# Altium project LineDetector.PrjPcb
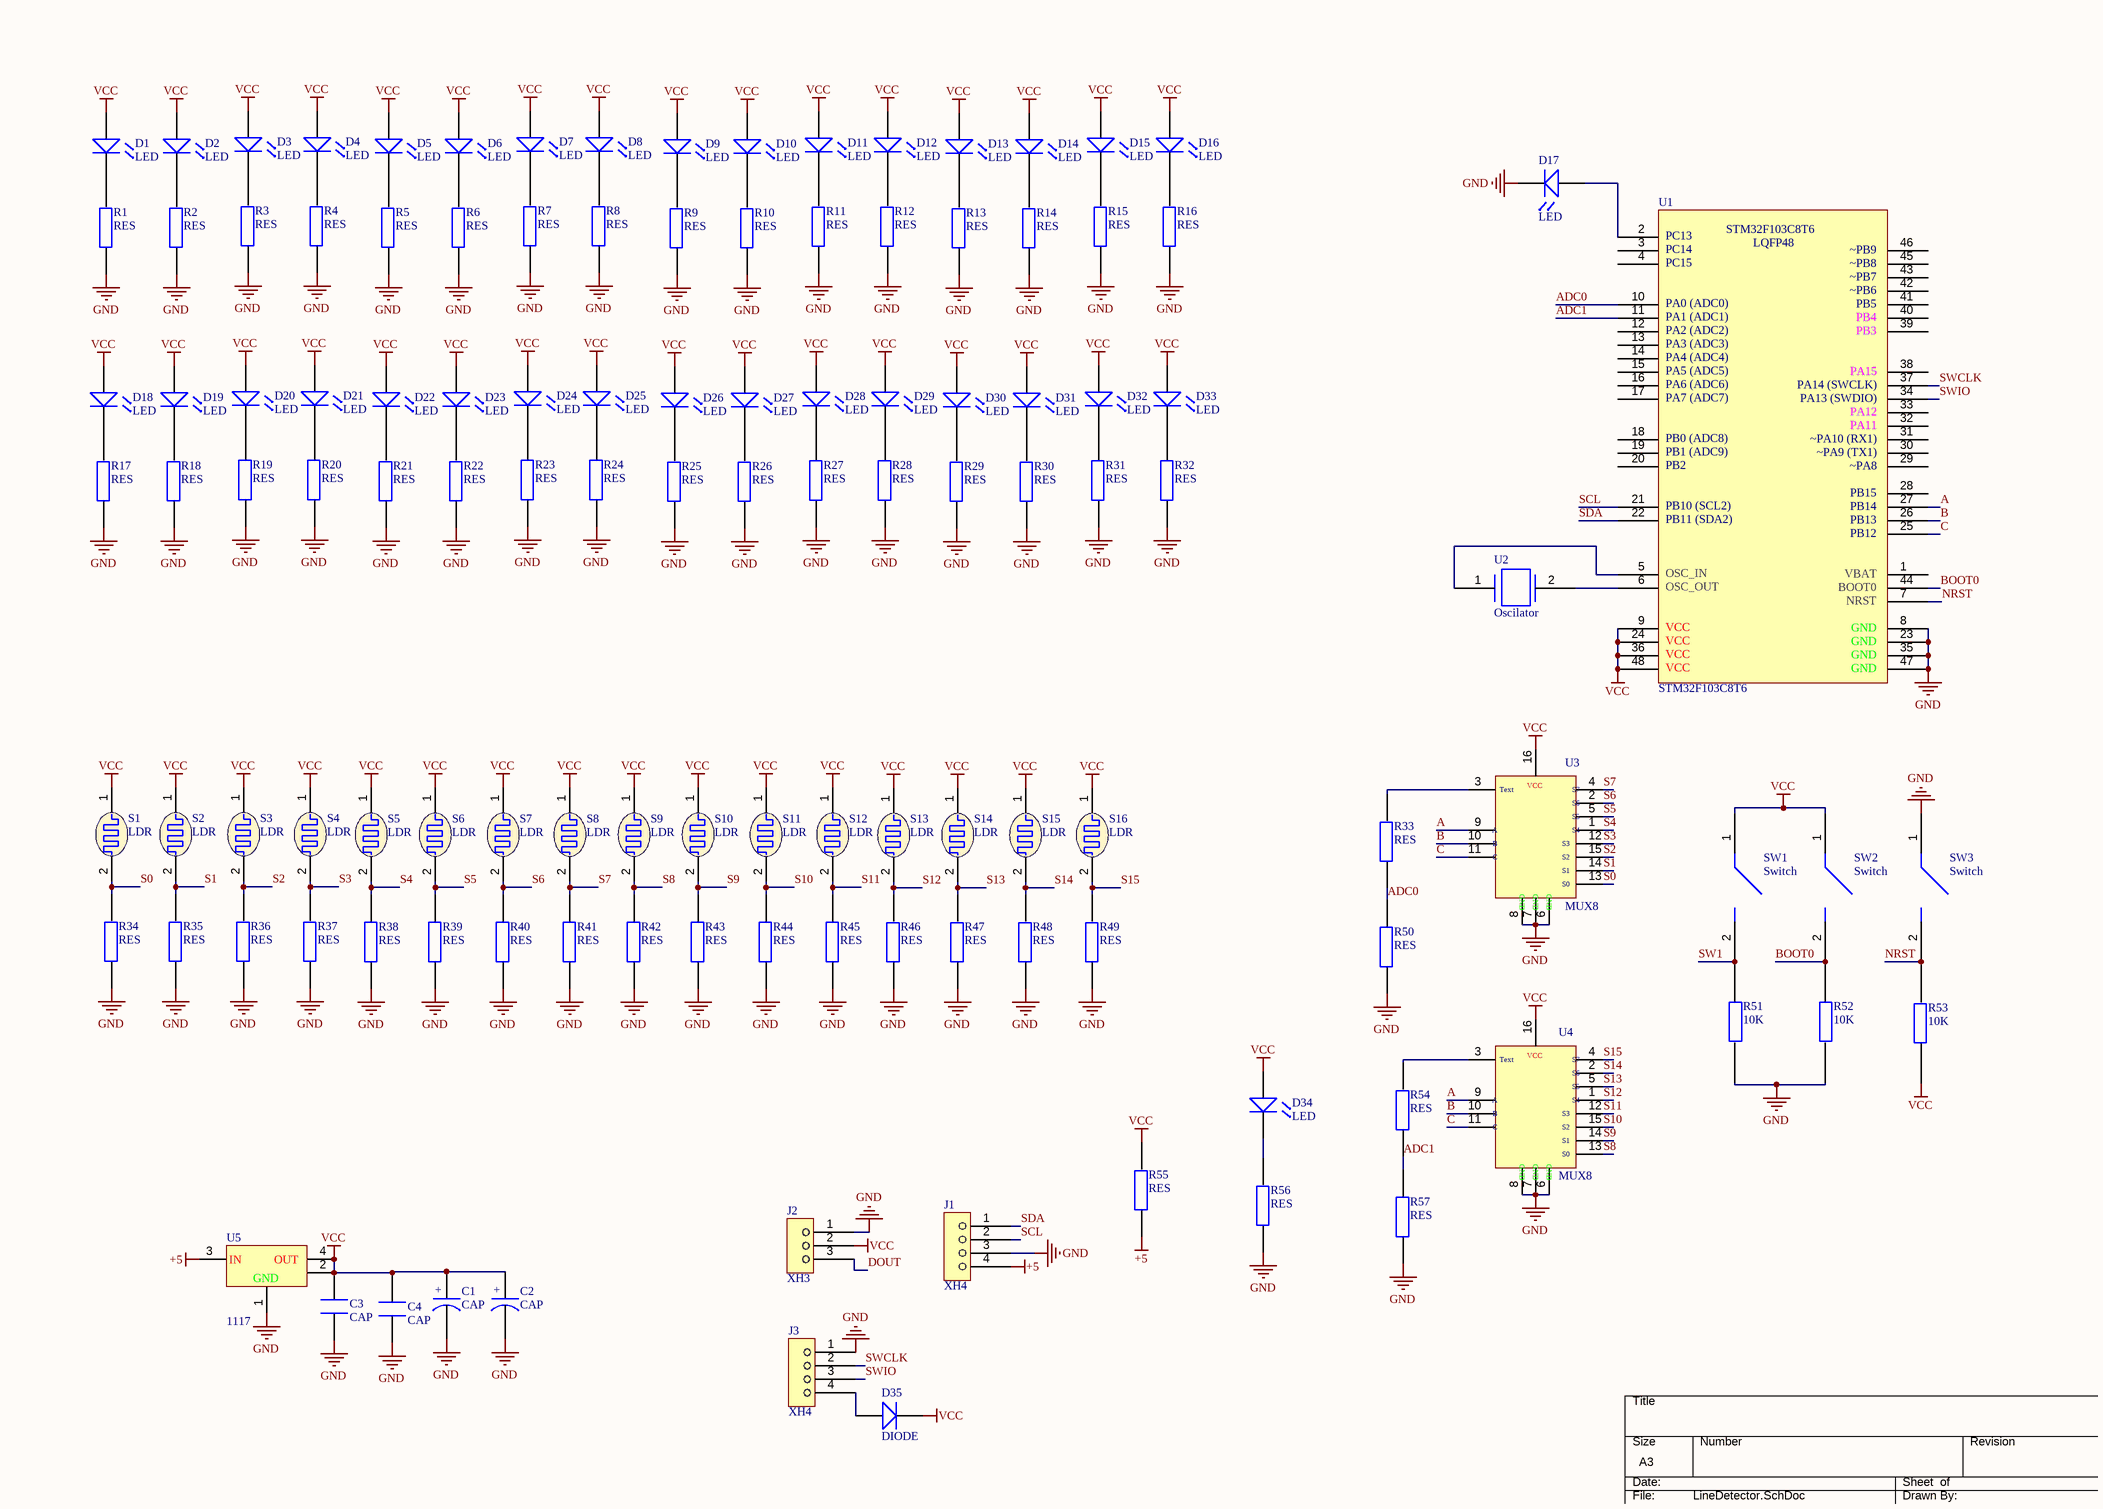
[diagram p0: LineDetector.SchDoc]
1 sheet, 123 parts. Net scope: global (net labels, ports and power ports of the same name join across sheets).
Board file: LineDetector.PcbDoc

## Sheet LineDetector.SchDoc
size A3; SheetNumber: 1; SheetTotal: 1

### Parts
C1  CAP  [CAP SMD 100uF 16V]
C2  CAP  [CAP SMD 100uF 16V]
C3  CAP  [CAP1206]
C4  CAP  [CAP1206]
D1  LED  [LED RED 1206]
D2  LED  [LED RED 1206]
D3  LED  [LED RED 1206]
D4  LED  [LED RED 1206]
D5  LED  [LED RED 1206]
D6  LED  [LED RED 1206]
D7  LED  [LED RED 1206]
D8  LED  [LED RED 1206]
D9  LED  [LED RED 1206]
D10  LED  [LED RED 1206]
D11  LED  [LED RED 1206]
D12  LED  [LED RED 1206]
D13  LED  [LED RED 1206]
D14  LED  [LED RED 1206]
D15  LED  [LED RED 1206]
D16  LED  [LED RED 1206]
D17  LED  [LED GREEN 1206]
D18  LED  [LED RED 1206]
D19  LED  [LED RED 1206]
D20  LED  [LED RED 1206]
D21  LED  [LED RED 1206]
D22  LED  [LED RED 1206]
D23  LED  [LED RED 1206]
D24  LED  [LED RED 1206]
D25  LED  [LED RED 1206]
D26  LED  [LED RED 1206]
D27  LED  [LED RED 1206]
D28  LED  [LED RED 1206]
D29  LED  [LED RED 1206]
D30  LED  [LED RED 1206]
D31  LED  [LED RED 1206]
D32  LED  [LED RED 1206]
D33  LED  [LED RED 1206]
D34  LED  [LED GREEN 1206]
D35  DIODE  [Diode]
J1  XH4  [XH 4PIN]
J2  XH3  [XH 3PIN]
J3  XH4  [XH 4PIN]
R1  RES  [RES805]
R2  RES  [RES805]
R3  RES  [RES805]
R4  RES  [RES805]
R5  RES  [RES805]
R6  RES  [RES805]
R7  RES  [RES805]
R8  RES  [RES805]
R9  RES  [RES805]
R10  RES  [RES805]
R11  RES  [RES805]
R12  RES  [RES805]
R13  RES  [RES805]
R14  RES  [RES805]
R15  RES  [RES805]
R16  RES  [RES805]
R17  RES  [RES805]
R18  RES  [RES805]
R19  RES  [RES805]
R20  RES  [RES805]
R21  RES  [RES805]
R22  RES  [RES805]
R23  RES  [RES805]
R24  RES  [RES805]
R25  RES  [RES805]
R26  RES  [RES805]
R27  RES  [RES805]
R28  RES  [RES805]
R29  RES  [RES805]
R30  RES  [RES805]
R31  RES  [RES805]
R32  RES  [RES805]
R33  RES  [RES1206]
R34  RES  [RES805]
R35  RES  [RES805]
R36  RES  [RES805]
R37  RES  [RES805]
R38  RES  [RES805]
R39  RES  [RES805]
R40  RES  [RES805]
R41  RES  [RES805]
R42  RES  [RES805]
R43  RES  [RES805]
R44  RES  [RES805]
R45  RES  [RES805]
R46  RES  [RES805]
R47  RES  [RES805]
R48  RES  [RES805]
R49  RES  [RES805]
R50  RES  [RES1206]
R51  10K  [RES1206]
R52  10K  [RES1206]
R53  10K  [RES1206]
R54  RES  [RES1206]
R55  RES  [RES805]
R56  RES  [RES805]
R57  RES  [RES1206]
S1  LDR  [LDR]
S2  LDR  [LDR]
S3  LDR  [LDR]
S4  LDR  [LDR]
S5  LDR  [LDR]
S6  LDR  [LDR]
S7  LDR  [LDR]
S8  LDR  [LDR]
S9  LDR  [LDR]
S10  LDR  [LDR]
S11  LDR  [LDR]
S12  LDR  [LDR]
S13  LDR  [LDR]
S14  LDR  [LDR]
S15  LDR  [LDR]
S16  LDR  [LDR]
SW1  Switch  [pushbutton]
SW2  Switch  [pushbutton]
SW3  Switch  [pushbutton]
U1  STM32F103C8T6  [STM32F103C8T6]
U2  Oscilator  [Crystal Oscilator]
U3  MUX8  [4051 SMD]
U4  MUX8  [4051 SMD]
U5  1117  [AMS1117]

### Nets
+5: J1.4 R55.1 U5.3
GND: C1.1 C2.1 C3.1 C4.1 D17.2 J1.3 J2.1 J3.1 R1.1 R2.1 R3.1 R4.1 R5.1 R6.1 R7.1 R8.1 R9.1 R10.1 R11.1 R12.1 R13.1 R14.1 R15.1 R16.1 R17.1 R18.1 R19.1 R20.1 R21.1 R22.1 R23.1 R24.1 R25.1 R26.1 R27.1 R28.1 R29.1 R30.1 R31.1 R32.1 R34.1 R35.1 R36.1 R37.1 R38.1 R39.1 R40.1 R41.1 R42.1 R43.1 R44.1 R45.1 R46.1 R47.1 R48.1 R49.1 R50.1 R51.2 R52.2 R56.1 R57.1 SW3.1 U1.8 U1.23 U1.35 U1.47 U3.6 U3.7 U3.8 U4.6 U4.7 U4.8 U5.1
VCC: C1.2 C2.2 C3.2 C4.2 D1.1 D2.1 D3.1 D4.1 D5.1 D6.1 D7.1 D8.1 D9.1 D10.1 D11.1 D12.1 D13.1 D14.1 D15.1 D16.1 D18.1 D19.1 D20.1 D21.1 D22.1 D23.1 D24.1 D25.1 D26.1 D27.1 D28.1 D29.1 D30.1 D31.1 D32.1 D33.1 D34.1 D35.2 J2.2 R53.1 R55.2 S1.1 S2.1 S3.1 S4.1 S5.1 S6.1 S7.1 S8.1 S9.1 S10.1 S11.1 S12.1 S13.1 S14.1 S15.1 S16.1 SW1.1 SW2.1 U1.9 U1.24 U1.36 U1.48 U3.16 U4.16 U5.2 U5.4
A: U1.27 U3.9 U4.9
ADC0: R33.1 R50.2 U1.10
ADC1: R54.1 R57.2 U1.11
B: U1.26 U3.10 U4.10
BOOT0: R52.1 SW2.2 U1.44
C: U1.25 U3.11 U4.11
DOUT: J2.3
NRST: R53.2 SW3.2 U1.7
S0: R34.2 S1.2 U3.13
S1: R35.2 S2.2 U3.14
S2: R36.2 S3.2 U3.15
S3: R37.2 S4.2 U3.12
S4: R38.2 S5.2 U3.1
S5: R39.2 S6.2 U3.5
S6: R40.2 S7.2 U3.2
S7: R41.2 S8.2 U3.4
S8: R42.2 S9.2 U4.13
S9: R43.2 S10.2 U4.14
S10: R44.2 S11.2 U4.15
S11: R45.2 S12.2 U4.12
S12: R46.2 S13.2 U4.1
S13: R47.2 S14.2 U4.5
S14: R48.2 S15.2 U4.2
S15: R49.2 S16.2 U4.4
SCL: J1.2 U1.21
SDA: J1.1 U1.22
SW1: R51.1 SW1.2
SWCLK: J3.2 U1.37
SWIO: J3.3 U1.34
NetD1_2: D1.2 R1.2
NetD2_2: D2.2 R2.2
NetD3_2: D3.2 R3.2
NetD4_2: D4.2 R4.2
NetD5_2: D5.2 R5.2
NetD6_2: D6.2 R6.2
NetD7_2: D7.2 R7.2
NetD8_2: D8.2 R8.2
NetD9_2: D9.2 R9.2
NetD10_2: D10.2 R10.2
NetD11_2: D11.2 R11.2
NetD12_2: D12.2 R12.2
NetD13_2: D13.2 R13.2
NetD14_2: D14.2 R14.2
NetD15_2: D15.2 R15.2
NetD16_2: D16.2 R16.2
NetD17_1: D17.1 U1.2
NetD18_2: D18.2 R17.2
NetD19_2: D19.2 R18.2
NetD20_2: D20.2 R19.2
NetD21_2: D21.2 R20.2
NetD22_2: D22.2 R21.2
NetD23_2: D23.2 R22.2
NetD24_2: D24.2 R23.2
NetD25_2: D25.2 R24.2
NetD26_2: D26.2 R25.2
NetD27_2: D27.2 R26.2
NetD28_2: D28.2 R27.2
NetD29_2: D29.2 R28.2
NetD30_2: D30.2 R29.2
NetD31_2: D31.2 R30.2
NetD32_2: D32.2 R31.2
NetD33_2: D33.2 R32.2
NetD34_2: D34.2 R56.2
NetD35_1: D35.1 J3.4
NetR33_2: R33.2 U3.3
NetR54_2: R54.2 U4.3
NetU1_5: U1.5 U2.1
NetU1_6: U1.6 U2.2

Not connected (* = marked no-connect by the designer): U1 1 3 4 12 13 14 15 16 17 18 19 20 28 29 30 31 32 33 38 39 40 41 42 43 45 46

### Notes on the sheet
- THIS DOCUMENT AND THE DATA DISCLOSED HEREIN OR
- HEREWITH IS THE PROPERTY OF ALTIUM LIMITED AND MAY
- DWG NO:
- REVISION
- REV:
- DESCRIPTION
- DATE
- APPROVED
- BE FREELY DISTRIBUTED IN WHOLE. NO RIGHTS ARE
- RESERVED OR EXPRESS OR IMPLIED WARANTEE GIVEN.
- ENG:
- APPROVALS
- PROJECT
- DSN:
- CHK:
- REFERENCE DOCUMENTS
- PROJECT REVISION:
- TITLE
- DOCUMENT REVISION:
- DESIGN ITEM:
- BOM:
- FAB DWG:
- PCB DWG:
- ASSY DWG:
- SCALE:
- A3
- SIZE
- CAGE CODE
- FILE NAME
- DWG NO.
- SHEET
- OF
- REV
- (in symbol 4051) VCC; Text; S7; S6; S5; A; S4; B; S3; C; S2; S1; S0; GND
- (in symbol AMS1117) IN; OUT; GND
- (in symbol CAP Electrolit SMD) +
- (in symbol STM32F103C8T6) PC13; LQFP48; ~PB9; PC14; ~PB8; PC15; ~PB7; ~PB6; PB5; PA0 (ADC0); PB4; PA1 (ADC1); PB3; PA2 (ADC2); PA3 (ADC3); PA4 (ADC4); PA15; PA5 (ADC5); PA14 (SWCLK); PA6 (ADC6); PA13 (SWDIO); PA7 (ADC7); PA12; PA11; ~PA10 (RX1); PB0 (ADC8); ~PA9 (TX1); PB1 (ADC9); ~PA8; PB2; PB15; PB14; PB10 (SCL2); PB13; PB11 (SDA2); PB12; VBAT; OSC_IN; BOOT0; OSC_OUT; NRST; GND; VCC

### Library data of the parts
C1 C2 = CAP Electrolit SMD: Capacitor Electrolit SMD
C3 C4 = CAP1206: Capacitor SMD 1206
D1-D34 = LED SMD 1206
J1 J3 = XH 4PIN: XH Connector 4pins
J2 = XH 3PIN: XH Connector 3pins
R1-R32 R34-R49 R55 R56 = RES805: RESISTOR SMD
R33 R50-R54 R57 = RES1206: RESISTOR SMD
S1-S16 = LDR: Light Emmiting Diode - photocell
SW1-SW3 = pushbutton: Switch SMD Tact
U1 = STM32F103C8T6: STM32F103C8T6 / LQFP48
U2 = Crystal: Crystal Oscilator 8MHz
U3 U4 = 4051: MULTIPLEXER 8 BIT
U5 = AMS1117: 3.3v Regulator